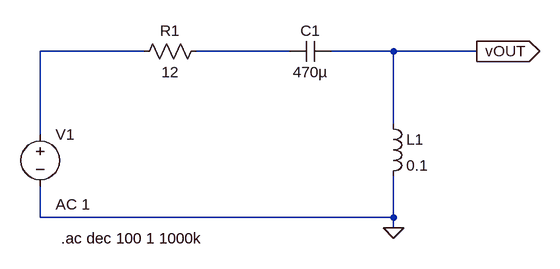
[diagram p0: schematic HPF.asc]
HPF.asc, the LTspice schematic file:
Version 4
SHEET 1 880 680
WIRE 192 0 32 0
WIRE 416 0 272 0
WIRE 576 0 480 0
WIRE 704 0 576 0
WIRE 576 112 576 0
WIRE 32 128 32 0
WIRE 32 256 32 208
WIRE 576 256 576 192
WIRE 576 256 32 256
WIRE 576 272 576 256
FLAG 576 272 0
FLAG 704 0 vOUT
IOPIN 704 0 Out
SYMBOL voltage 32 112 R0
WINDOW 123 24 124 Left 2
WINDOW 39 0 0 Left 0
SYMATTR InstName V1
SYMATTR Value ""
SYMATTR Value2 AC 1
SYMBOL res 288 -16 R90
WINDOW 0 0 56 VBottom 2
WINDOW 3 32 56 VTop 2
SYMATTR InstName R1
SYMATTR Value 12
SYMBOL cap 480 -16 R90
WINDOW 0 0 32 VBottom 2
WINDOW 3 32 32 VTop 2
SYMATTR InstName C1
SYMATTR Value 470µ
SYMBOL ind 560 96 R0
SYMATTR InstName L1
SYMATTR Value 0.1
TEXT 64 288 Left 2 !.ac dec 100 1 1000k

The netlist it stands for:
* HPF.asc
V1 N001 0 AC 1
R1 N002 N001 12
C1 vOUT N002 470µ
L1 vOUT 0 0.1
.ac dec 100 1 1000k
.backanno
.end